# Altium schematic sheet Schematic F450.SchDoc
size A4; SheetNumber: 1; SheetTotal: 1
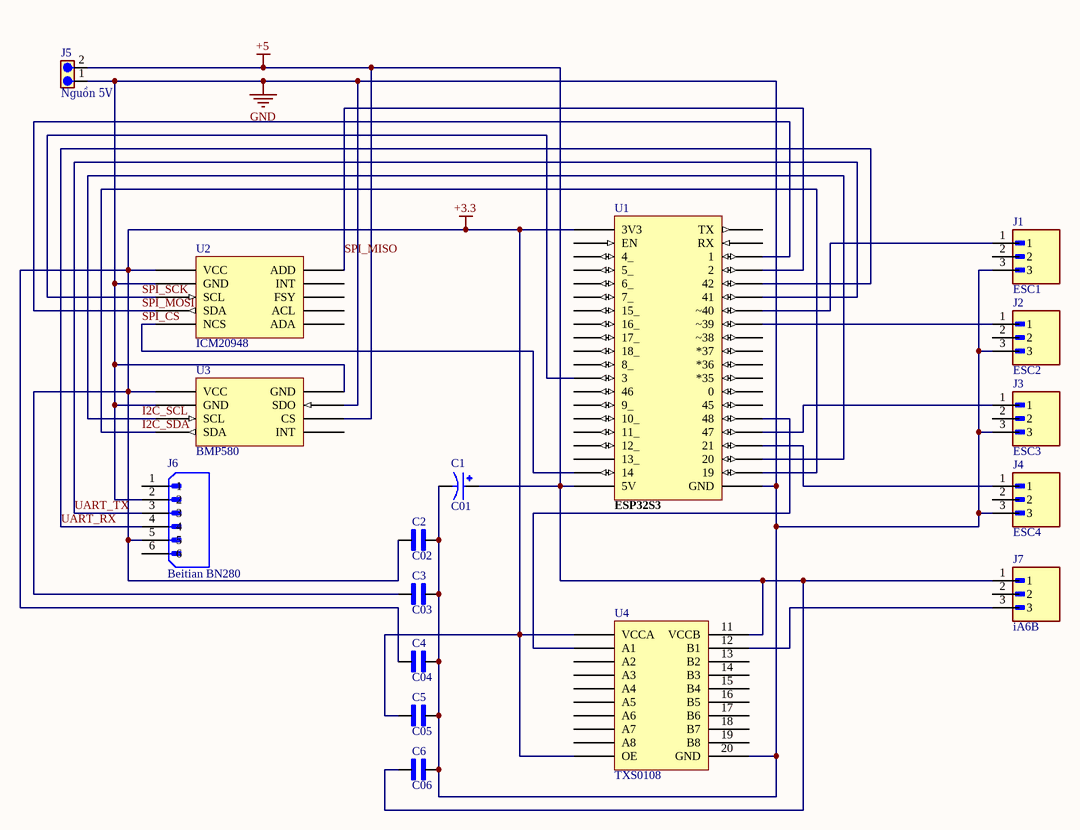
[diagram p0: Schematic F450.SchDoc]

## Parts
C1  C01  [CAPPRD500W60D1000H1250]
C2  C02  [CAPRR254W54L381T254H466]
C3  C03  [CAPRR254W54L381T254H466]
C4  C04  [CAPRR254W54L381T254H466]
C5  C05  [CAPRR254W54L381T254H466]
C6  C06  [CAPRR254W54L381T254H466]
J1  ESC1  [WURTH_61300311121]
J2  ESC2  [WURTH_61300311121]
J3  ESC3  [WURTH_61300311121]
J4  ESC4  [WURTH_61300311121]
J5  Nguồn 5V  [61300211121]
J6  Beitian BN280  [MOLEX_530470610]
J7  iA6B  [WURTH_61300311121]
U1  ESP32S3  [ESP32S3]  (value not drawn)
U2  ICM20948  [ICM20948]
U3  BMP580  [BMP580]
U4  TXS0108  [TXS0108]

## Nets
+3.3: C2.1 C3.1 C4.1 C5.1 J6.5 U1.21(3V3) U2.1(VCC) U3.1(VCC) U4.1(VCCA) U4.10(OE)
+5: C1.P C6.1 J5.2 J7.1 U1.40(5V) U3.7(CS) U4.11(VCCB)
GND: C1.N C2.2 C3.2 C4.2 C5.2 C6.2 J1.3 J2.3 J3.3 J4.3 J5.1 J6.2 U1.20(GND) U2.2(GND) U3.2(GND) U3.5(GND) U3.6(SDO) U4.20(GND)
I2C_SCL: U1.18(20) U3.3(SCL)
I2C_SDA: U1.19 U3.4(SDA)
SPI_CS: U1.39(14) U2.5(NCS)
SPI_MISO: U1.4(2) U2.6(ADD)
SPI_MOSI: U1.3(1) U2.4(SDA)
SPI_SCK: U1.32(3) U2.3(SCL)
UART_RX: J6.4 U1.5(42)
UART_TX: J6.3 U1.6(41)
NetJ1_1: J1.1 U1.7(~40)
NetJ2_1: J2.1 U1.8(~39)
NetJ3_1: J3.1 U1.16(47)
NetJ4_1: J4.1 U1.17(21)
NetJ7_3: J7.3 U4.12(B1)
NetU1_15: U1.15(48) U4.2(A1)

Not connected (* = marked no-connect by the designer): J1 2; J2 2; J3 2; J4 2; J6 1 6; J7 2; U1 1(TX) 2(RX) 9(~38) 10(*37) 11(*36) 12(*35) 13(0) 14(45) 22(EN) 23(4_) 24(5_) 25(6_) 26(7_) 27(15_) 28(16_) 29(17_) 30(18_) 31(8_) 33(46) 34(9_) 35(10_) 36(11_) 37(12_) 38(13_); U2 7(INT) 8(FSY) 9(ACL) 10(ADA); U3 8(INT); U4 3(A2) 4(A3) 5(A4) 6(A5) 7(A6) 8(A7) 9(A8) 13(B2) 14(B3) 15(B4) 16(B5) 17(B6) 18(B7) 19(B8)

## Library data of the parts
C1 = EEUFK1E471B: CAP ALUM 470UF 20% 25V RADIAL TH; MF: Panasonic; SnapEDA_Link: https://www.snapeda.com/parts/EEUFK1E471B/Panasonic/view-part/?ref=snap; Check_prices: https://www.snapeda.com/parts/EEUFK1E471B/Panasonic/view-part/?ref=eda; MP: EEUFK1E471B; Availability: In Stock; Package: RADIAL-2 Panasonic; Price: None; Value: *
C2-C6 = C315C104K1R5TA: 315 C 100nF Ceramic Multilayer Capacitor, 100 VDC, +125degC, X7R Dielec, +/-10% | KEMET C315C104K1R5TA; SnapEDA_Link: https://www.snapeda.com/parts/C315C104K1R5TA/KEMET/view-part/?ref=snap; Package: Radial Kemet; Value: *; MF: KEMET; MP: C315C104K1R5TA; Check_prices: https://www.snapeda.com/parts/C315C104K1R5TA/KEMET/view-part/?ref=eda
J1-J4 = 61300311121: Package: None; Price: None; Value: *; MP: 61300311121; Availability: Unavailable
J5 = 6130XX11121_61300211121: MF: {'manufacturer': u'Wurth Electronics'}; Package: None; Price: None; Value: *; MP: 61300211121; Availability: Unavailable
J6 = 530470610: Connector Header Through Hole 6 position 0.049 (1.25mm); MF: Molex; Purchase-URL: https://pricing.snapeda.com/search/part/530470610/?ref=eda; Package: None; SnapEDA_Link: https://www.snapeda.com/parts/530470610/Molex/view-part/?ref=snap; MP: 530470610; Value: *; Check_prices: https://www.snapeda.com/parts/530470610/Molex/view-part/?ref=eda; Digi-Key_Part_Number: WM1735-ND
J7 = 61300311121: Receiver for FC; Package: None; Price: None; Value: *; MP: 61300311121; Availability: Unavailable